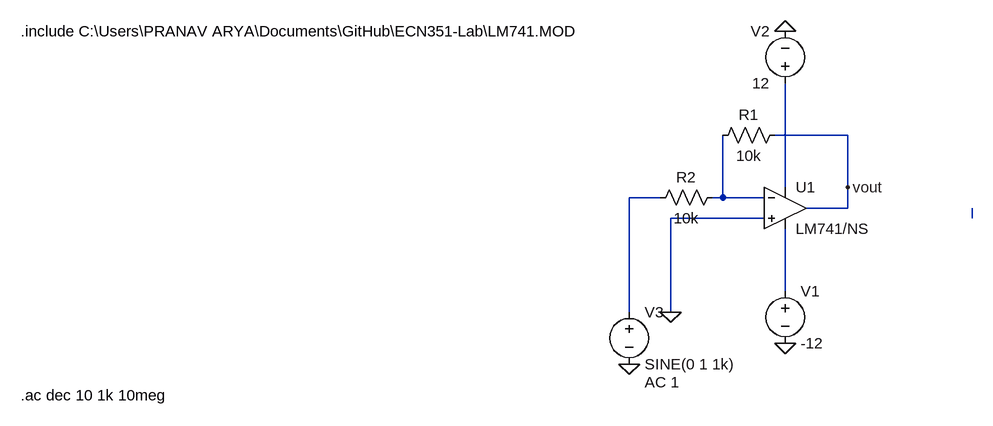
[diagram p0: schematic invertor.asc]
invertor.asc, the LTspice schematic file:
Version 4
SHEET 1 880 680
WIRE 368 16 256 16
WIRE 272 96 272 -64
WIRE 368 96 368 16
WIRE 80 112 32 112
WIRE 176 112 176 16
WIRE 176 112 160 112
WIRE 240 112 176 112
WIRE 368 128 368 96
WIRE 368 128 304 128
WIRE 240 144 96 144
WIRE 560 144 560 128
WIRE 272 256 272 160
WIRE 32 288 32 112
WIRE 96 288 96 144
FLAG 272 336 0
FLAG 272 -144 0
FLAG 96 288 0
FLAG 32 368 0
FLAG 368 96 vout
SYMBOL OpAmps\\opamp2 272 64 R0
SYMATTR InstName U1
SYMATTR Value LM741/NS
SYMBOL voltage 272 240 R0
WINDOW 123 0 0 Left 0
WINDOW 39 0 0 Left 0
SYMATTR InstName V1
SYMATTR Value -12
SYMBOL voltage 272 -48 R180
WINDOW 0 24 96 Left 2
WINDOW 3 24 16 Left 2
WINDOW 123 0 0 Left 0
WINDOW 39 0 0 Left 0
SYMATTR InstName V2
SYMATTR Value 12
SYMBOL res 272 0 R90
WINDOW 0 0 56 VBottom 2
WINDOW 3 32 56 VTop 2
SYMATTR InstName R1
SYMATTR Value 10k
SYMBOL res 176 96 R90
WINDOW 0 0 56 VBottom 2
WINDOW 3 32 56 VTop 2
SYMATTR InstName R2
SYMATTR Value 10k
SYMBOL voltage 32 272 R0
WINDOW 123 24 124 Left 2
WINDOW 39 0 0 Left 0
SYMATTR Value2 AC 1
SYMATTR InstName V3
SYMATTR Value SINE(0 1 1k)
TEXT -904 -144 Left 2 !.include C:\\Users\\PRANAV ARYA\\Documents\\GitHub\\ECN351-Lab\\LM741.MOD
TEXT -904 416 Left 2 !.ac dec 10 1k 10meg

The netlist it stands for:
* invertor.asc
XU1 0 N003 N001 N005 vout LM741/NS  ; pins In+ In- V+ V- OUT
V1 N005 0 -12
V2 N001 0 12
R1 vout N003 10k
R2 N003 N002 10k
V3 N002 0 SINE(0 1 1k) AC 1
.include C:\Users\PRANAV ARYA\Documents\GitHub\ECN351-Lab\LM741.MOD
.ac dec 10 1k 10meg
.backanno
.end